# Altium schematic sheet BluetoothModule.SchDoc
size A4
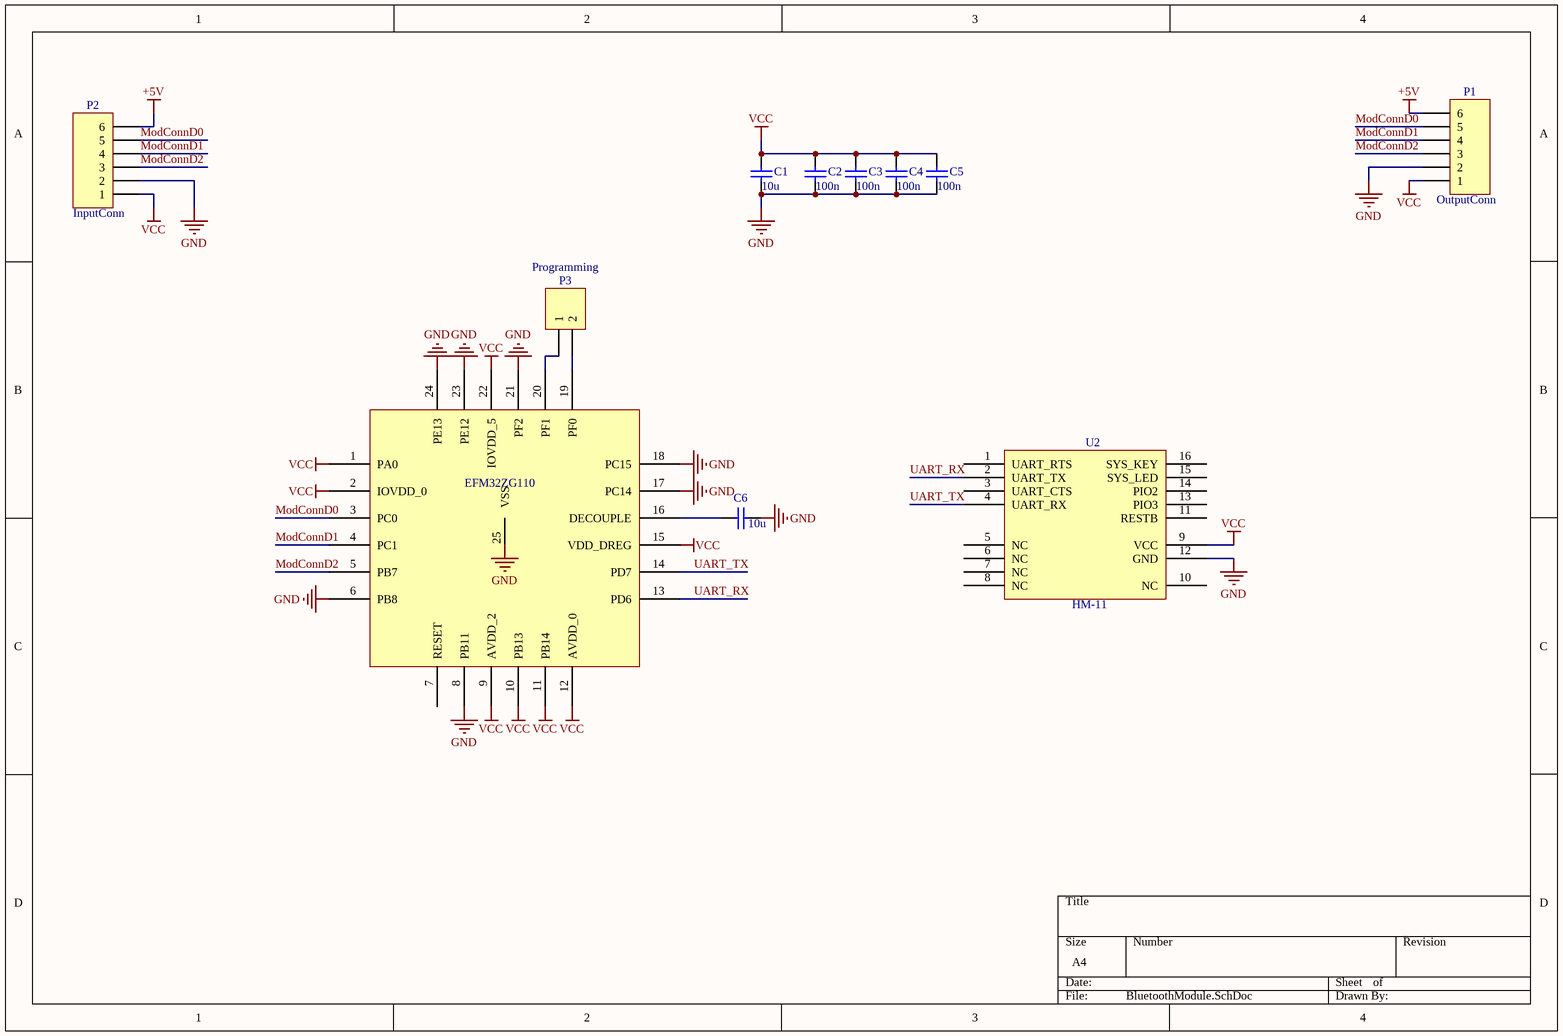
[diagram p0: BluetoothModule.SchDoc]

## Parts
C1  10u  [0805]
C2  value 100n  [0402]  (hidden comment: Cap Semi)
C3  value 100n  [0402]  (hidden comment: Cap Semi)
C4  value 100n  [0402]  (hidden comment: Cap Semi)
C5  value 100n  [0402]  (hidden comment: Cap Semi)
C6  10u  [0805]
P1  OutputConn  [Goldpin6_1.27mm]
P2  InputConn  [Goldpin6_1.27mm]
P3  Programming  [GeckoProgramming]
U1  EFM32ZG110  [QFN24_5x5_0.65]
U2  HM-11  [HM-11]

## Nets
+5V: P1.6 P2.6
GND: C1.1 C2.1 C3.1 C4.1 C5.1 C6.1 P1.2 P2.2 U1.6(PB8) U1.8(PB11) U1.17(PC14) U1.18(PC15) U1.21(PF2) U1.23(PE12) U1.24(PE13) U1.25(VSS) U2.12(GND)
VCC: C1.2 C2.2 C3.2 C4.2 C5.2 P1.1 P2.1 U1.1(PA0) U1.2(IOVDD_0) U1.9(AVDD_2) U1.10(PB13) U1.11(PB14) U1.12(AVDD_0) U1.15(VDD_DREG) U1.22(IOVDD_5) U2.9(VCC)
ModConnD0: P1.5 P2.5 U1.3(PC0)
ModConnD1: P1.4 P2.4 U1.4(PC1)
ModConnD2: P1.3 P2.3 U1.5(PB7)
UART_RX: U1.13(PD6) U2.2(UART_TX)
UART_TX: U1.14(PD7) U2.4(UART_RX)
NetC6_2: C6.2 U1.16(DECOUPLE)
NetP3_1: P3.1 U1.20(PF1)
NetP3_2: P3.2 U1.19(PF0)

Not connected (* = marked no-connect by the designer): U1 7(RESET); U2 1(UART_RTS) 3(UART_CTS) 5(NC) 6(NC) 7(NC) 8(NC) 10(NC) 11(RESTB) 13(PIO3) 14(PIO2) 15(SYS_LED) 16(SYS_KEY)

## Library data of the parts
C1-C6 = Cap Semi: Capacitor (Semiconductor SIM Model); Published: 8-Jun-2000; LatestRevisionDate: 29-May-2009; LatestRevisionNote: IPC-7351 Footprint Added.; PackageReference: C1206; Publisher: Altium Limited; PackageDescription: Chip Capacitor
  C1 C6: Value: 10u
P1 P2 = MHDR1X6: Header, 6-Pin; LatestRevisionDate: 17-Jul-2002; LatestRevisionNote: Re-released for DXP Platform.; Publisher: Altium Limited
P3 = MHDR1X2: Header, 2-Pin; LatestRevisionDate: 17-Jul-2002; LatestRevisionNote: Re-released for DXP Platform.; Publisher: Altium Limited